# EAGLE schematic fullSketch (EAGLE 7.6.0)
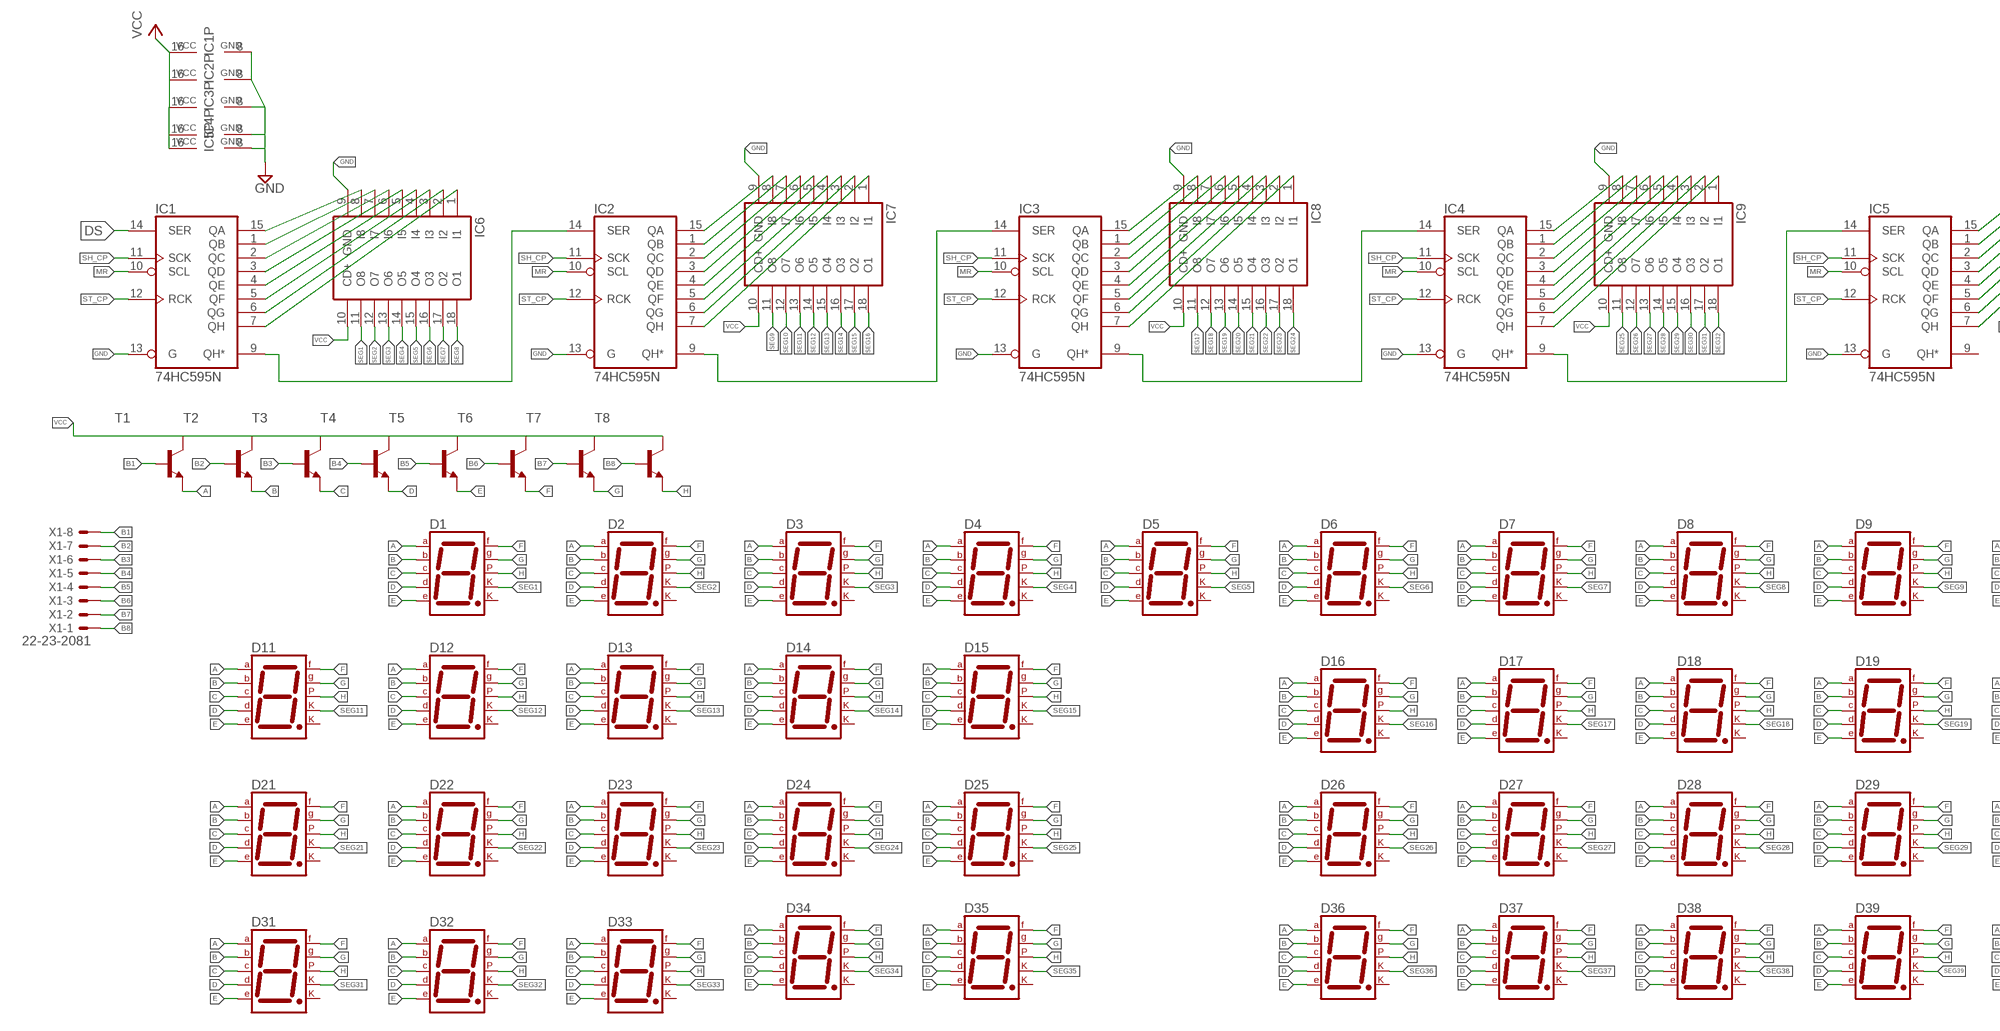
[diagram p0: schematic, sheet 1, part 1 of 2]
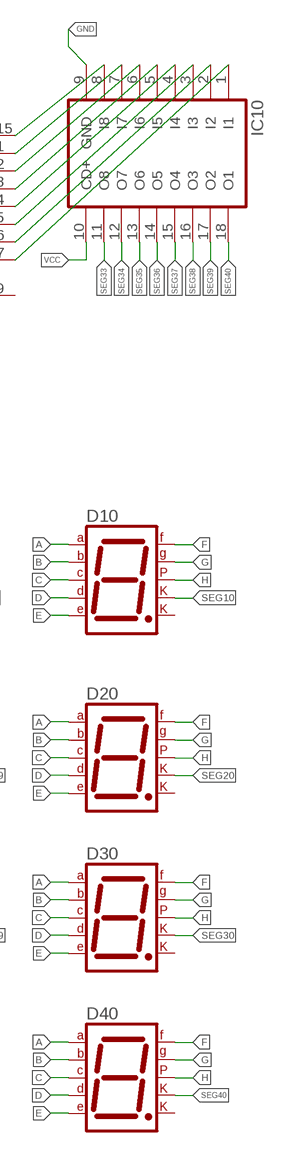
[diagram p1: schematic, sheet 1, part 2 of 2]

## Parts
D1  7SEG-CK  [7SEG-13]
D2  7SEG-CK  [7SEG-13]
D3  7SEG-CK  [7SEG-13]
D4  7SEG-CK  [7SEG-13]
D5  7SEG-CK  [7SEG-13]
D6  7SEG-CK  [7SEG-13]
D7  7SEG-CK  [7SEG-13]
D8  7SEG-CK  [7SEG-13]
D9  7SEG-CK  [7SEG-13]
D10  7SEG-CK  [7SEG-13]
D11  7SEG-CK  [7SEG-13]
D12  7SEG-CK  [7SEG-13]
D13  7SEG-CK  [7SEG-13]
D14  7SEG-CK  [7SEG-13]
D15  7SEG-CK  [7SEG-13]
D16  7SEG-CK  [7SEG-13]
D17  7SEG-CK  [7SEG-13]
D18  7SEG-CK  [7SEG-13]
D19  7SEG-CK  [7SEG-13]
D20  7SEG-CK  [7SEG-13]
D21  7SEG-CK  [7SEG-13]
D22  7SEG-CK  [7SEG-13]
D23  7SEG-CK  [7SEG-13]
D24  7SEG-CK  [7SEG-13]
D25  7SEG-CK  [7SEG-13]
D26  7SEG-CK  [7SEG-13]
D27  7SEG-CK  [7SEG-13]
D28  7SEG-CK  [7SEG-13]
D29  7SEG-CK  [7SEG-13]
D30  7SEG-CK  [7SEG-13]
D31  7SEG-CK  [7SEG-13]
D32  7SEG-CK  [7SEG-13]
D33  7SEG-CK  [7SEG-13]
D34  7SEG-CK  [7SEG-13]
D35  7SEG-CK  [7SEG-13]
D36  7SEG-CK  [7SEG-13]
D37  7SEG-CK  [7SEG-13]
D38  7SEG-CK  [7SEG-13]
D39  7SEG-CK  [7SEG-13]
D40  7SEG-CK  [7SEG-13]
IC1  74HC595N  [DIL16]
IC2  74HC595N  [DIL16]
IC3  74HC595N  [DIL16]
IC4  74HC595N  [DIL16]
IC5  74HC595N  [DIL16]
IC6  ULN2803A  [DIL18]
IC7  ULN2803A  [DIL18]
IC8  ULN2803A  [DIL18]
IC9  ULN2803A  [DIL18]
IC10  ULN2803A  [DIL18]
T1  -NPN-TO92  [TO92]
T2  -NPN-TO92  [TO92]
T3  -NPN-TO92  [TO92]
T4  -NPN-TO92  [TO92]
T5  -NPN-TO92  [TO92]
T6  -NPN-TO92  [TO92]
T7  -NPN-TO92  [TO92]
T8  -NPN-TO92  [TO92]
X1  22-23-2081  [22-23-2081]

## Nets
A: D1.7(A) D2.7(A) D3.7(A) D4.7(A) D5.7(A) D6.7(A) D7.7(A) D8.7(A) D9.7(A) D10.7(A) D11.7(A) D12.7(A) D13.7(A) D14.7(A) D15.7(A) D16.7(A) D17.7(A) D18.7(A) D19.7(A) D20.7(A) D21.7(A) D22.7(A) D23.7(A) D24.7(A) D25.7(A) D26.7(A) D27.7(A) D28.7(A) D29.7(A) D30.7(A) D31.7(A) D32.7(A) D33.7(A) D34.7(A) D35.7(A) D36.7(A) D37.7(A) D38.7(A) D39.7(A) D40.7(A) T1.1(E)
B: D1.6(B) D2.6(B) D3.6(B) D4.6(B) D5.6(B) D6.6(B) D7.6(B) D8.6(B) D9.6(B) D10.6(B) D11.6(B) D12.6(B) D13.6(B) D14.6(B) D15.6(B) D16.6(B) D17.6(B) D18.6(B) D19.6(B) D20.6(B) D21.6(B) D22.6(B) D23.6(B) D24.6(B) D25.6(B) D26.6(B) D27.6(B) D28.6(B) D29.6(B) D30.6(B) D31.6(B) D32.6(B) D33.6(B) D34.6(B) D35.6(B) D36.6(B) D37.6(B) D38.6(B) D39.6(B) D40.6(B) T2.1(E)
B1: T1.2(B) X1.8
B2: T2.2(B) X1.7
B3: T3.2(B) X1.6
B4: T4.2(B) X1.5
B5: T5.2(B) X1.4
B6: T6.2(B) X1.3
B7: T7.2(B) X1.2
B8: T8.2(B) X1.1
C: D1.4(C) D2.4(C) D3.4(C) D4.4(C) D5.4(C) D6.4(C) D7.4(C) D8.4(C) D9.4(C) D10.4(C) D11.4(C) D12.4(C) D13.4(C) D14.4(C) D15.4(C) D16.4(C) D17.4(C) D18.4(C) D19.4(C) D20.4(C) D21.4(C) D22.4(C) D23.4(C) D24.4(C) D25.4(C) D26.4(C) D27.4(C) D28.4(C) D29.4(C) D30.4(C) D31.4(C) D32.4(C) D33.4(C) D34.4(C) D35.4(C) D36.4(C) D37.4(C) D38.4(C) D39.4(C) D40.4(C) T3.1(E)
D: D1.2(D) D2.2(D) D3.2(D) D4.2(D) D5.2(D) D6.2(D) D7.2(D) D8.2(D) D9.2(D) D10.2(D) D11.2(D) D12.2(D) D13.2(D) D14.2(D) D15.2(D) D16.2(D) D17.2(D) D18.2(D) D19.2(D) D20.2(D) D21.2(D) D22.2(D) D23.2(D) D24.2(D) D25.2(D) D26.2(D) D27.2(D) D28.2(D) D29.2(D) D30.2(D) D31.2(D) D32.2(D) D33.2(D) D34.2(D) D35.2(D) D36.2(D) D37.2(D) D38.2(D) D39.2(D) D40.2(D) T4.1(E)
DS: IC1.14(SER)
E: D1.1(E) D2.1(E) D3.1(E) D4.1(E) D5.1(E) D6.1(E) D7.1(E) D8.1(E) D9.1(E) D10.1(E) D11.1(E) D12.1(E) D13.1(E) D14.1(E) D15.1(E) D16.1(E) D17.1(E) D18.1(E) D19.1(E) D20.1(E) D21.1(E) D22.1(E) D23.1(E) D24.1(E) D25.1(E) D26.1(E) D27.1(E) D28.1(E) D29.1(E) D30.1(E) D31.1(E) D32.1(E) D33.1(E) D34.1(E) D35.1(E) D36.1(E) D37.1(E) D38.1(E) D39.1(E) D40.1(E) T5.1(E)
F: D1.9(F) D2.9(F) D3.9(F) D4.9(F) D5.9(F) D6.9(F) D7.9(F) D8.9(F) D9.9(F) D10.9(F) D11.9(F) D12.9(F) D13.9(F) D14.9(F) D15.9(F) D16.9(F) D17.9(F) D18.9(F) D19.9(F) D20.9(F) D21.9(F) D22.9(F) D23.9(F) D24.9(F) D25.9(F) D26.9(F) D27.9(F) D28.9(F) D29.9(F) D30.9(F) D31.9(F) D32.9(F) D33.9(F) D34.9(F) D35.9(F) D36.9(F) D37.9(F) D38.9(F) D39.9(F) D40.9(F) T6.1(E)
G: D1.10(G) D2.10(G) D3.10(G) D4.10(G) D5.10(G) D6.10(G) D7.10(G) D8.10(G) D9.10(G) D10.10(G) D11.10(G) D12.10(G) D13.10(G) D14.10(G) D15.10(G) D16.10(G) D17.10(G) D18.10(G) D19.10(G) D20.10(G) D21.10(G) D22.10(G) D23.10(G) D24.10(G) D25.10(G) D26.10(G) D27.10(G) D28.10(G) D29.10(G) D30.10(G) D31.10(G) D32.10(G) D33.10(G) D34.10(G) D35.10(G) D36.10(G) D37.10(G) D38.10(G) D39.10(G) D40.10(G) T7.1(E)
GND: IC1.8(GND) IC1.13(G) IC2.8(GND) IC2.13(G) IC3.8(GND) IC3.13(G) IC4.8(GND) IC4.13(G) IC5.8(GND) IC5.13(G) IC6.9(GND) IC7.9(GND) IC8.9(GND) IC9.9(GND) IC10.9(GND)
H: D1.5(DP) D2.5(DP) D3.5(DP) D4.5(DP) D5.5(DP) D6.5(DP) D7.5(DP) D8.5(DP) D9.5(DP) D10.5(DP) D11.5(DP) D12.5(DP) D13.5(DP) D14.5(DP) D15.5(DP) D16.5(DP) D17.5(DP) D18.5(DP) D19.5(DP) D20.5(DP) D21.5(DP) D22.5(DP) D23.5(DP) D24.5(DP) D25.5(DP) D26.5(DP) D27.5(DP) D28.5(DP) D29.5(DP) D30.5(DP) D31.5(DP) D32.5(DP) D33.5(DP) D34.5(DP) D35.5(DP) D36.5(DP) D37.5(DP) D38.5(DP) D39.5(DP) D40.5(DP) T8.1(E)
MR: IC1.10(SCL) IC2.10(SCL) IC3.10(SCL) IC4.10(SCL) IC5.10(SCL)
N$1: IC1.15(QA) IC6.8(I8)
N$2: IC1.1(QB) IC6.7(I7)
N$3: IC1.2(QC) IC6.6(I6)
N$4: IC1.3(QD) IC6.5(I5)
N$5: IC1.4(QE) IC6.4(I4)
N$6: IC1.5(QF) IC6.3(I3)
N$7: IC1.6(QG) IC6.2(I2)
N$8: IC1.7(QH) IC6.1(I1)
N$9: IC2.15(QA) IC7.8(I8)
N$10: IC2.1(QB) IC7.7(I7)
N$11: IC2.2(QC) IC7.6(I6)
N$12: IC2.3(QD) IC7.5(I5)
N$13: IC2.4(QE) IC7.4(I4)
N$14: IC2.5(QF) IC7.3(I3)
N$15: IC2.6(QG) IC7.2(I2)
N$16: IC2.7(QH) IC7.1(I1)
N$17: IC3.15(QA) IC8.8(I8)
N$18: IC3.1(QB) IC8.7(I7)
N$19: IC3.2(QC) IC8.6(I6)
N$20: IC3.3(QD) IC8.5(I5)
N$21: IC3.4(QE) IC8.4(I4)
N$22: IC3.5(QF) IC8.3(I3)
N$23: IC3.6(QG) IC8.2(I2)
N$24: IC3.7(QH) IC8.1(I1)
N$25: IC4.15(QA) IC9.8(I8)
N$26: IC4.1(QB) IC9.7(I7)
N$27: IC4.2(QC) IC9.6(I6)
N$28: IC4.3(QD) IC9.5(I5)
N$29: IC4.4(QE) IC9.4(I4)
N$30: IC4.5(QF) IC9.3(I3)
N$31: IC4.6(QG) IC9.2(I2)
N$32: IC4.7(QH) IC9.1(I1)
N$33: IC5.15(QA) IC10.8(I8)
N$34: IC5.1(QB) IC10.7(I7)
N$35: IC5.2(QC) IC10.6(I6)
N$36: IC5.3(QD) IC10.5(I5)
N$37: IC5.4(QE) IC10.4(I4)
N$38: IC5.5(QF) IC10.3(I3)
N$39: IC5.6(QG) IC10.2(I2)
N$40: IC5.7(QH) IC10.1(I1)
N$94: IC1.9(QH*) IC2.14(SER)
N$103: IC2.9(QH*) IC3.14(SER)
N$112: IC3.9(QH*) IC4.14(SER)
N$121: IC4.9(QH*) IC5.14(SER)
SEG1: D1.3(CK1) IC6.11(O8)
SEG2: D2.3(CK1) IC6.12(O7)
SEG3: D3.3(CK1) IC6.13(O6)
SEG4: D4.3(CK1) IC6.14(O5)
SEG5: D5.3(CK1) IC6.15(O4)
SEG6: D6.3(CK1) IC6.16(O3)
SEG7: D7.3(CK1) IC6.17(O2)
SEG8: D8.3(CK1) IC6.18(O1)
SEG9: D9.3(CK1) IC7.11(O8)
SEG10: D10.3(CK1) IC7.12(O7)
SEG11: D11.3(CK1) IC7.13(O6)
SEG12: D12.3(CK1) IC7.14(O5)
SEG13: D13.3(CK1) IC7.15(O4)
SEG14: D14.3(CK1) IC7.16(O3)
SEG15: D15.3(CK1) IC7.17(O2)
SEG16: D16.3(CK1) IC7.18(O1)
SEG17: D17.3(CK1) IC8.11(O8)
SEG18: D18.3(CK1) IC8.12(O7)
SEG19: D19.3(CK1) IC8.13(O6)
SEG20: D20.3(CK1) IC8.14(O5)
SEG21: D21.3(CK1) IC8.15(O4)
SEG22: D22.3(CK1) IC8.16(O3)
SEG23: D23.3(CK1) IC8.17(O2)
SEG24: D24.3(CK1) IC8.18(O1)
SEG25: D25.3(CK1) IC9.11(O8)
SEG26: D26.3(CK1) IC9.12(O7)
SEG27: D27.3(CK1) IC9.13(O6)
SEG28: D28.3(CK1) IC9.14(O5)
SEG29: D29.3(CK1) IC9.15(O4)
SEG30: D30.3(CK1) IC9.16(O3)
SEG31: D31.3(CK1) IC9.17(O2)
SEG32: D32.3(CK1) IC9.18(O1)
SEG33: D33.3(CK1) IC10.11(O8)
SEG34: D34.3(CK1) IC10.12(O7)
SEG35: D35.3(CK1) IC10.13(O6)
SEG36: D36.3(CK1) IC10.14(O5)
SEG37: D37.3(CK1) IC10.15(O4)
SEG38: D38.3(CK1) IC10.16(O3)
SEG39: D39.3(CK1) IC10.17(O2)
SEG40: D40.3(CK1) IC10.18(O1)
SH_CP: IC1.11(SCK) IC2.11(SCK) IC3.11(SCK) IC4.11(SCK) IC5.11(SCK)
ST_CP: IC1.12(RCK) IC2.12(RCK) IC3.12(RCK) IC4.12(RCK) IC5.12(RCK)
VCC: IC1.16(VCC) IC2.16(VCC) IC3.16(VCC) IC4.16(VCC) IC5.16(VCC) IC6.10(CD+) IC7.10(CD+) IC8.10(CD+) IC9.10(CD+) IC10.10(CD+) T1.3(C) T2.3(C) T3.3(C) T4.3(C) T5.3(C) T6.3(C) T7.3(C) T8.3(C)
Unconnected: D1.8(CK2) D2.8(CK2) D3.8(CK2) D4.8(CK2) D5.8(CK2) D6.8(CK2) D7.8(CK2) D8.8(CK2) D9.8(CK2) D10.8(CK2) D11.8(CK2) D12.8(CK2) D13.8(CK2) D14.8(CK2) D15.8(CK2) D16.8(CK2) D17.8(CK2) D18.8(CK2) D19.8(CK2) D20.8(CK2) D21.8(CK2) D22.8(CK2) D23.8(CK2) D24.8(CK2) D25.8(CK2) D26.8(CK2) D27.8(CK2) D28.8(CK2) D29.8(CK2) D30.8(CK2) D31.8(CK2) D32.8(CK2) D33.8(CK2) D34.8(CK2) D35.8(CK2) D36.8(CK2) D37.8(CK2) D38.8(CK2) D39.8(CK2) D40.8(CK2) IC5.9(QH*)

## Library data of the parts
D1-D40 = special:7SEG-CK: 7-segment DISPLAY single cathode, 13 mm
IC1-IC5 = 74xx-eu:74*595: 8-bit SHIFT REGISTER, output latch
IC6-IC10 = uln-udn:ULN2803A: DRIVER ARRAY
T1-T8 = transistor:*-NPN-: NPN Transistror BF959 corrected 2008.03.06
X1 = con-molex:22-23-2081: .100" (2.54mm) Center Header - 8 Pin; MF: MOLEX; MPN: 22-23-2081; OC_FARNELL: 1756826; OC_NEWARK: 01C7592

## Net classes
0 default: clearance 0.254 mm